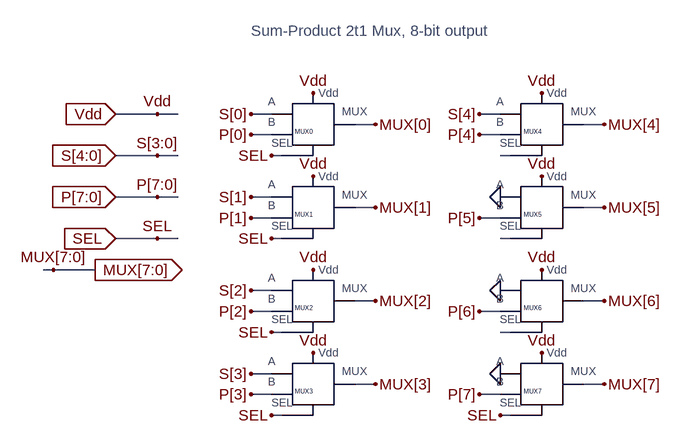
[diagram p0: schematic sum_prod_mux.asc]
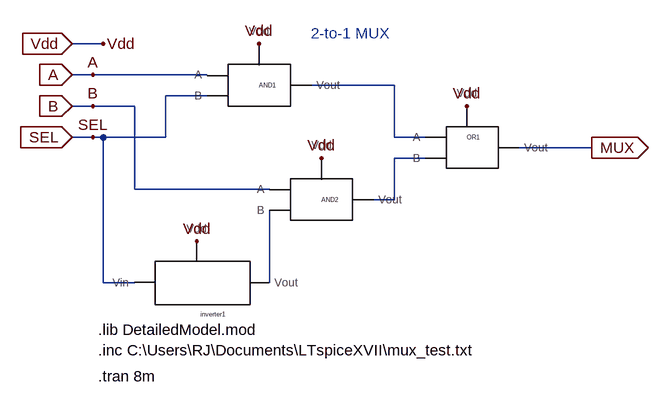
[diagram p1: sub-circuit mux2t1.asc]
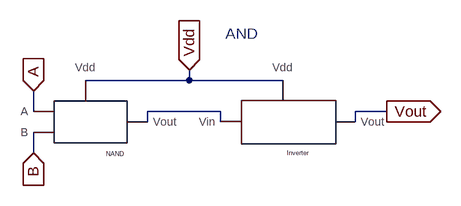
[diagram p2: sub-circuit my_and.asc]
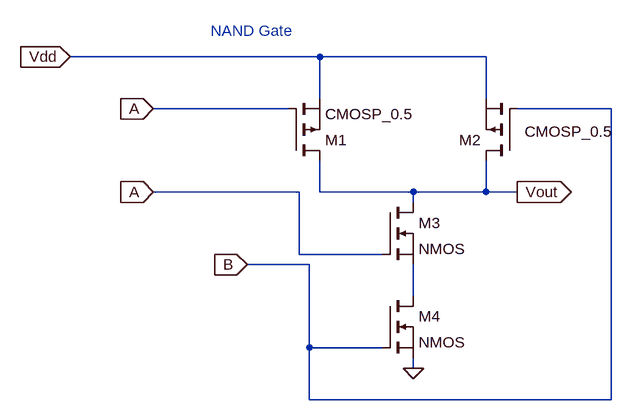
[diagram p3: sub-circuit my_nand.asc]
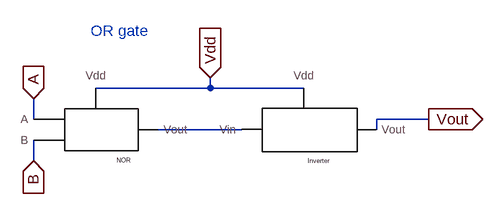
[diagram p4: sub-circuit my_or.asc]
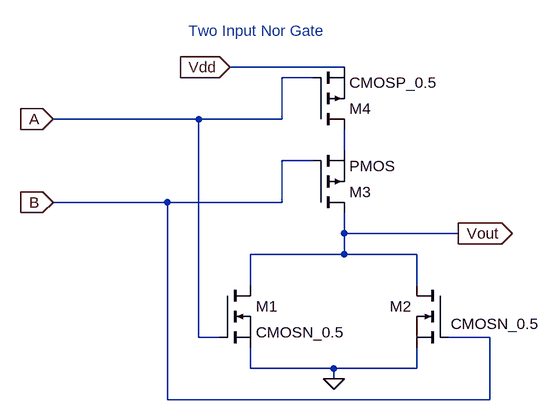
[diagram p5: sub-circuit my_nor.asc]
sum_prod_mux.asc, the LTspice schematic file:
Version 4
SHEET 1 952 680
WIRE 160 -48 96 -48
WIRE 192 -48 160 -48
WIRE 336 -48 304 -48
WIRE 688 -48 656 -48
WIRE 496 -32 464 -32
WIRE 848 -32 816 -32
WIRE 336 -16 304 -16
WIRE 688 -16 656 -16
WIRE 160 16 96 16
WIRE 192 16 160 16
WIRE 352 16 336 16
WIRE 704 16 688 16
WIRE 160 80 96 80
WIRE 192 80 160 80
WIRE 336 80 304 80
WIRE 496 96 464 96
WIRE 848 96 816 96
WIRE 336 112 304 112
WIRE 688 112 656 112
WIRE 160 144 96 144
WIRE 192 144 160 144
WIRE 352 144 336 144
WIRE 704 144 688 144
WIRE 0 192 -16 192
WIRE 64 192 0 192
WIRE 336 224 304 224
WIRE 496 240 464 240
WIRE 848 240 816 240
WIRE 336 256 304 256
WIRE 688 256 656 256
WIRE 352 288 336 288
WIRE 704 288 688 288
WIRE 336 352 304 352
WIRE 496 368 464 368
WIRE 848 368 816 368
WIRE 336 384 304 384
WIRE 688 384 656 384
WIRE 352 416 336 416
WIRE 704 416 688 416
FLAG 96 16 S[4:0]
IOPIN 96 16 In
FLAG 96 80 P[7:0]
IOPIN 96 80 In
FLAG 96 144 SEL
IOPIN 96 144 In
FLAG 96 -48 Vdd
IOPIN 96 -48 In
FLAG 64 192 MUX[7:0]
IOPIN 64 192 Out
FLAG 160 -48 Vdd
FLAG 160 16 S[3:0]
FLAG 160 80 P[7:0]
FLAG 160 144 SEL
FLAG 0 192 MUX[7:0]
FLAG 400 -80 Vdd
FLAG 752 -80 Vdd
FLAG 400 48 Vdd
FLAG 752 48 Vdd
FLAG 752 192 Vdd
FLAG 400 192 Vdd
FLAG 752 320 Vdd
FLAG 400 320 Vdd
FLAG 688 352 0
FLAG 688 224 0
FLAG 688 80 0
FLAG 304 -48 S[0]
FLAG 304 -16 P[0]
FLAG 304 80 S[1]
FLAG 304 224 S[2]
FLAG 304 112 P[1]
FLAG 304 256 P[2]
FLAG 304 352 S[3]
FLAG 304 384 P[3]
FLAG 656 -48 S[4]
FLAG 656 -16 P[4]
FLAG 656 112 P[5]
FLAG 656 256 P[6]
FLAG 656 384 P[7]
FLAG 336 16 SEL
FLAG 336 144 SEL
FLAG 336 288 SEL
FLAG 336 416 SEL
FLAG 688 416 SEL
FLAG 496 -32 MUX[0]
FLAG 496 96 MUX[1]
FLAG 496 240 MUX[2]
FLAG 496 368 MUX[3]
FLAG 848 -32 MUX[4]
FLAG 848 96 MUX[5]
FLAG 848 240 MUX[6]
FLAG 848 368 MUX[7]
SYMBOL mux2t1 400 -32 R0
SYMATTR InstName MUX0
SYMBOL mux2t1 400 96 R0
SYMATTR InstName MUX1
SYMBOL mux2t1 400 240 R0
SYMATTR InstName MUX2
SYMBOL mux2t1 400 368 R0
SYMATTR InstName MUX3
SYMBOL mux2t1 752 -32 R0
SYMATTR InstName MUX4
SYMBOL mux2t1 752 96 R0
SYMATTR InstName MUX5
SYMBOL mux2t1 752 240 R0
SYMATTR InstName MUX6
SYMBOL mux2t1 752 368 R0
SYMATTR InstName MUX7
TEXT 304 -176 Left 2 ;Sum-Product 2t1 Mux, 8-bit output

mux2t1.asc, the sub-circuit schematic file:
Version 4
SHEET 1 928 680
WIRE 64 48 16 48
WIRE 48 96 16 96
WIRE 224 96 48 96
WIRE 512 112 384 112
WIRE 224 128 160 128
WIRE 48 144 16 144
WIRE 112 144 48 144
WIRE 48 192 16 192
WIRE 64 192 48 192
WIRE 160 192 160 128
WIRE 160 192 64 192
WIRE 512 192 512 112
WIRE 560 192 512 192
WIRE 816 208 704 208
WIRE 560 224 512 224
WIRE 112 272 112 144
WIRE 320 272 112 272
WIRE 512 288 512 224
WIRE 512 288 480 288
WIRE 64 416 64 192
WIRE 112 416 64 416
WIRE 320 416 320 304
FLAG 16 96 A
IOPIN 16 96 In
FLAG 48 96 A
FLAG 16 144 B
IOPIN 16 144 In
FLAG 48 144 B
FLAG 16 192 SEL
IOPIN 16 192 In
FLAG 48 192 SEL
FLAG 816 208 MUX
IOPIN 816 208 Out
FLAG 304 48 Vdd
FLAG 208 352 Vdd
FLAG 400 224 Vdd
FLAG 624 144 Vdd
FLAG 16 48 Vdd
IOPIN 16 48 In
FLAG 64 48 Vdd
SYMBOL my_and 304 112 R0
WINDOW 0 0 0 Left 0
SYMATTR InstName AND1
SYMBOL my_and 400 288 R0
WINDOW 0 0 0 Left 0
SYMATTR InstName AND2
SYMBOL my_inverter 208 416 R0
SYMATTR InstName inverter1
SYMBOL my_or 624 192 R0
WINDOW 0 0 0 Left 0
SYMATTR InstName OR1
TEXT 384 32 Left 2 ;2-to-1 MUX
TEXT 56 488 Left 2 !.lib DetailedModel.mod
TEXT 56 520 Left 2 !.inc C:\\Users\\RJ\\Documents\\LTspiceXVII\\mux_test.txt
TEXT 56 560 Left 2 !.tran 8m

my_and.asc, the sub-circuit schematic file:
Version 4
SHEET 1 880 680
WIRE 288 112 288 96
WIRE 288 112 128 112
WIRE 432 112 288 112
WIRE 48 160 48 128
WIRE 336 160 224 160
WIRE 592 160 544 160
WIRE 224 176 224 160
WIRE 336 176 336 160
WIRE 544 176 544 160
WIRE 48 224 48 192
FLAG 48 128 A
IOPIN 48 128 In
FLAG 48 224 B
IOPIN 48 224 In
FLAG 288 96 Vdd
IOPIN 288 96 In
FLAG 592 160 Vout
IOPIN 592 160 Out
SYMBOL my_nand 128 176 R0
SYMATTR InstName NAND
SYMBOL my_inverter 432 176 R0
SYMATTR InstName Inverter
TEXT 344 40 Left 2 ;AND

my_nand.asc, the sub-circuit schematic file:
Version 4
SHEET 1 932 680
WIRE 480 -16 96 -16
WIRE 736 -16 480 -16
WIRE 480 48 480 -16
WIRE 736 48 736 -16
WIRE 432 64 224 64
WIRE 928 64 784 64
WIRE 448 192 224 192
WIRE 480 192 480 144
WIRE 624 192 480 192
WIRE 736 192 736 144
WIRE 736 192 624 192
WIRE 784 192 736 192
WIRE 624 208 624 192
WIRE 448 288 448 192
WIRE 576 288 448 288
WIRE 464 304 368 304
WIRE 624 352 624 304
WIRE 464 432 464 304
WIRE 576 432 464 432
WIRE 624 464 624 448
WIRE 464 512 464 432
WIRE 928 512 928 64
WIRE 928 512 464 512
FLAG 624 464 0
FLAG 96 -16 Vdd
IOPIN 96 -16 In
FLAG 224 64 A
IOPIN 224 64 In
FLAG 224 192 A
IOPIN 224 192 In
FLAG 368 304 B
IOPIN 368 304 In
FLAG 784 192 Vout
IOPIN 784 192 Out
SYMBOL pmos 432 144 M180
SYMATTR InstName M1
SYMATTR Value CMOSP_0.5
SYMBOL pmos 784 144 R180
WINDOW 3 -11 45 Right 2
SYMATTR Value CMOSP_0.5
SYMATTR InstName M2
SYMBOL nmos 576 208 R0
SYMATTR InstName M3
SYMBOL nmos 576 352 R0
SYMATTR InstName M4
TEXT 312 -56 Left 2 ;NAND Gate

my_or.asc, the sub-circuit schematic file:
Version 4
SHEET 1 880 680
WIRE 288 144 288 128
WIRE 288 144 112 144
WIRE 432 144 288 144
WIRE 16 192 16 160
WIRE 624 192 544 192
WIRE 336 208 208 208
WIRE 544 208 544 192
WIRE 16 256 16 224
FLAG 16 160 A
IOPIN 16 160 In
FLAG 16 256 B
IOPIN 16 256 In
FLAG 288 128 Vdd
IOPIN 288 128 In
FLAG 624 192 Vout
IOPIN 624 192 Out
SYMBOL my_nor 112 208 R0
SYMATTR InstName NOR
SYMBOL my_inverter 432 208 R0
SYMATTR InstName Inverter
TEXT 104 56 Left 2 ;OR gate

my_nor.asc, the sub-circuit schematic file:
Version 4
SHEET 1 880 680
WIRE 336 -240 160 -240
WIRE 288 -224 240 -224
WIRE 112 -160 -112 -160
WIRE 240 -160 240 -224
WIRE 240 -160 112 -160
WIRE 336 -112 336 -144
WIRE 288 -96 240 -96
WIRE 64 -32 -112 -32
WIRE 240 -32 240 -96
WIRE 240 -32 64 -32
WIRE 336 16 336 -16
WIRE 512 16 336 16
WIRE 336 48 336 16
WIRE 336 48 192 48
WIRE 448 48 336 48
WIRE 192 96 192 48
WIRE 448 96 448 48
WIRE 112 176 112 -160
WIRE 144 176 112 176
WIRE 560 176 496 176
WIRE 192 224 192 192
WIRE 320 224 192 224
WIRE 448 224 448 192
WIRE 448 224 320 224
WIRE 320 240 320 224
WIRE 64 272 64 -32
WIRE 560 272 560 176
WIRE 560 272 64 272
FLAG -112 -32 B
IOPIN -112 -32 In
FLAG -112 -160 A
IOPIN -112 -160 In
FLAG 160 -240 Vdd
IOPIN 160 -240 In
FLAG 512 16 Vout
IOPIN 512 16 Out
FLAG 320 240 0
SYMBOL nmos 144 96 R0
SYMATTR InstName M1
SYMATTR Value CMOSN_0.5
SYMBOL nmos 496 96 M0
WINDOW 3 -141 59 Left 2
SYMATTR Value CMOSN_0.5
SYMATTR InstName M2
SYMBOL pmos 288 -144 M180
SYMATTR InstName M4
SYMATTR Value CMOSP_0.5
SYMBOL pmos 288 -16 M180
SYMATTR InstName M3
TEXT 96 -296 Left 2 ;Two Input Nor Gate

The netlist it stands for:
* sum_prod_mux.asc
XMUX0 S[0] P[0] SEL Vdd MUX[0] mux2t1
XMUX1 S[1] P[1] SEL Vdd MUX[1] mux2t1
XMUX2 S[2] P[2] SEL Vdd MUX[2] mux2t1
XMUX3 S[3] P[3] SEL Vdd MUX[3] mux2t1
XMUX4 S[4] P[4] N001 Vdd MUX[4] mux2t1
XMUX5 0 P[5] N002 Vdd MUX[5] mux2t1
XMUX6 0 P[6] N003 Vdd MUX[6] mux2t1
XMUX7 0 P[7] SEL Vdd MUX[7] mux2t1

* block symbol definitions
.subckt mux2t1 A B SEL Vdd MUX
XAND1 A SEL N001 Vdd my_and
XAND2 B N003 N002 Vdd my_and
Xinverter1 SEL Vdd N003 my_inverter  ; pins Vin Vdd Vout
XOR1 N001 N002 Vdd MUX my_or
* 2-to-1 MUX
.lib DetailedModel.mod
.inc C:\Users\RJ\Documents\LTspiceXVII\mux_test.txt
.tran 8m
.ends mux2t1

.subckt my_and A B Vout Vdd
XNAND A B N001 Vdd my_nand
XInverter N001 Vdd Vout my_inverter  ; pins Vin Vdd Vout
* AND
.ends my_and

.subckt my_nand A B Vout Vdd
M1 Vout A Vdd Vdd CMOSP_0.5
M2 Vout B Vdd Vdd CMOSP_0.5
M3 Vout A N001 N001 NMOS
M4 N001 B 0 0 NMOS
* NAND Gate
.ends my_nand

.subckt my_or A B Vdd Vout
XNOR A B N001 Vdd my_nor
XInverter N001 Vdd Vout my_inverter  ; pins Vin Vdd Vout
* OR gate
.ends my_or

.subckt my_nor A B Vout Vdd
M1 Vout A 0 0 CMOSN_0.5
M2 Vout B 0 0 CMOSN_0.5
M4 N001 A Vdd Vdd CMOSP_0.5
M3 Vout B N001 N001 PMOS
* Two Input Nor Gate
.ends my_nor

.model NMOS NMOS
.model PMOS PMOS
.lib standard.mos
* Sum-Product 2t1 Mux, 8-bit output
.backanno
.end